# Altium schematic sheet topLevel.SchDoc: Top Level Schematic
size A4; Organization: Grand Valley State University; Address1: 301 W Fulton St; Address2: Grand Rapids, MI; Address3: 49504; Revision: AA; SheetNumber: 1; SheetTotal: 6; ImagePath: "D:\git\altium-senior-project\gvsu_logo.jpg"
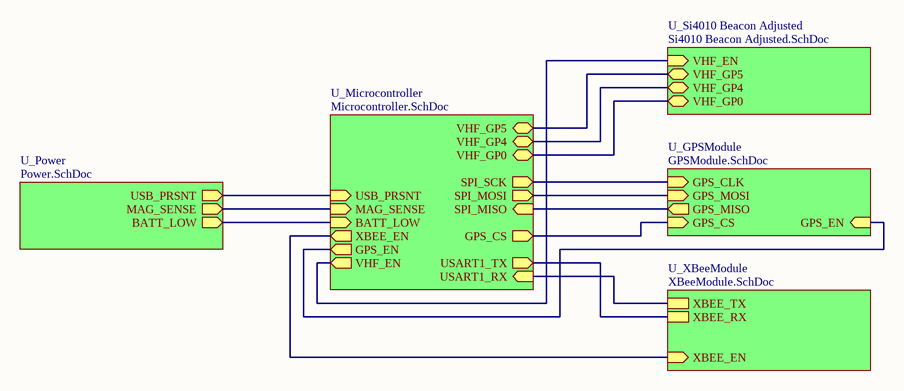
[diagram p0: topLevel.SchDoc]

## Sub-sheets
U_GPSModule = GPSModule.SchDoc: GPS_CLK (in), GPS_MISO (out), GPS_MOSI (in), GPS_CS (in), GPS_EN (in)
U_Microcontroller = Microcontroller.SchDoc: SPI_SCK (out), SPI_MISO (in), SPI_MOSI (out), GPS_CS (out), XBEE_EN (out), GPS_EN (out), VHF_EN (out), USB_PRSNT (in), MAG_SENSE (in), VHF_GP5 (bidir), VHF_GP4 (bidir), VHF_GP0 (bidir), BATT_LOW (in), USART1_TX (out), USART1_RX (in)
U_Power = Power.SchDoc: USB_PRSNT (out), MAG_SENSE (out), BATT_LOW (out)
U_Si4010 Beacon Adjusted = Si4010 Beacon Adjusted.SchDoc: VHF_EN (in), VHF_GP5 (bidir), VHF_GP4 (bidir), VHF_GP0 (bidir)
U_XBeeModule = XBeeModule.SchDoc: XBEE_EN (in), XBEE_TX, XBEE_RX

## Nets
(unnamed): sheet U_Power/USB_PRSNT, sheet U_Microcontroller/USB_PRSNT
(unnamed): sheet U_Power/MAG_SENSE, sheet U_Microcontroller/MAG_SENSE
(unnamed): sheet U_Power/BATT_LOW, sheet U_Microcontroller/BATT_LOW
(unnamed): sheet U_GPSModule/GPS_CLK, sheet U_Microcontroller/SPI_SCK
(unnamed): sheet U_GPSModule/GPS_MISO, sheet U_Microcontroller/SPI_MISO
(unnamed): sheet U_GPSModule/GPS_MOSI, sheet U_Microcontroller/SPI_MOSI
(unnamed): sheet U_GPSModule/GPS_CS, sheet U_Microcontroller/GPS_CS
(unnamed): sheet U_GPSModule/GPS_EN, sheet U_Microcontroller/GPS_EN
(unnamed): sheet U_Microcontroller/XBEE_EN, sheet U_XBeeModule/XBEE_EN
(unnamed): sheet U_Microcontroller/VHF_EN, sheet U_Si4010 Beacon Adjusted/VHF_EN
(unnamed): sheet U_Microcontroller/VHF_GP5, sheet U_Si4010 Beacon Adjusted/VHF_GP5
(unnamed): sheet U_Microcontroller/VHF_GP4, sheet U_Si4010 Beacon Adjusted/VHF_GP4
(unnamed): sheet U_Microcontroller/VHF_GP0, sheet U_Si4010 Beacon Adjusted/VHF_GP0
(unnamed): sheet U_Microcontroller/USART1_TX, sheet U_XBeeModule/XBEE_RX
(unnamed): sheet U_Microcontroller/USART1_RX, sheet U_XBeeModule/XBEE_TX

## Notes on the sheet
- Title
- Size:
- Date:
- A4
- Number:
- Time:
- Revision:
- Sheet
- of
- File: